# Altium schematic sheet Spinn.SchDoc
size A
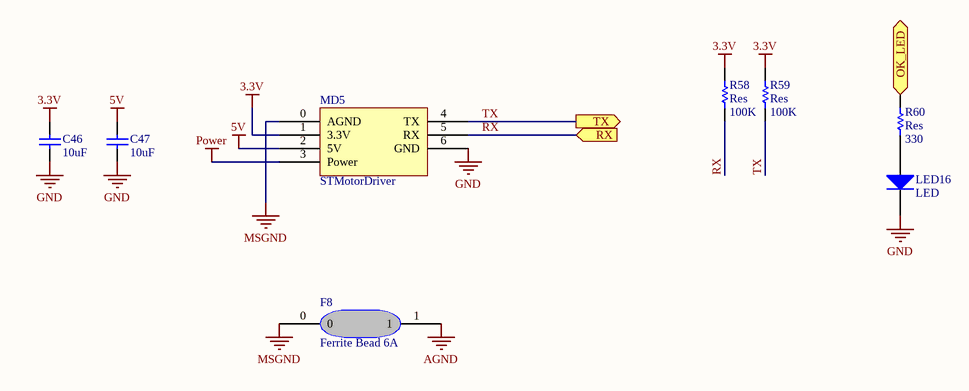
[diagram p0: Spinn.SchDoc]

## Parts
C46  value 10uF  [2012[0805]]  (hidden comment: Cap_UP)
C47  value 10uF  [2012[0805]]  (hidden comment: Cap_UP)
F8  Ferrite Bead 6A  [f6A]
LED16  LED  [2012[0805]]
MD5  STMotorDriver  [MotorDriver]
R58  Res  value 100K  [2012[0805]]
R59  Res  value 100K  [2012[0805]]
R60  Res  value 330  [2012[0805]]

## Ports
OK_LED (in), RX (in), TX (out)

## Nets
3.3V: C46.2 MD5.1(3.3V) R58.2 R59.2
5V: C47.2 MD5.2(5V)
AGND: F8.1
GND: C46.1 C47.1 LED16.2(K) MD5.6(GND)
MSGND: F8.0 MD5.0(AGND)
Power: MD5.3(Power)
OK_LED: R60.1 ; port OK_LED
RX: MD5.5(RX) R58.1 ; port RX
TX: MD5.4(TX) R59.1 ; port TX
NetLED16_1: LED16.1(A) R60.2

## Library data of the parts
C46 C47 = Cap_UP: Capacitor; Published: 8-Jun-2000; LatestRevisionDate: 17-Jul-2002; LatestRevisionNote: Re-released for DXP Platform.; PackageReference: RAD-0.3; Publisher: Altium Limited
F8 = F6A
LED16 = Diode: 1 Amp General Purpose Rectifier; Revision 1: 11-Jul-2000: SIM Model Added.; Revision 2: 17-Jul-2002: Re-released for DXP Platform.; Package Information: Latest Revision: Aug-1999; Code - JEDEC: DO-204-AL; Published: 8-Jun-2000; Datasheet: Latest Revision: 1998; Package Reference: DO-41; Publisher: Altium Limited
R58-R60 = Res: Semiconductor Resistor; Published: 8-Jun-2000; LatestRevisionDate: 17-Jul-2002; LatestRevisionNote: Re-released for DXP Platform.; PackageReference: AXIAL-0.5; Publisher: Altium Limited